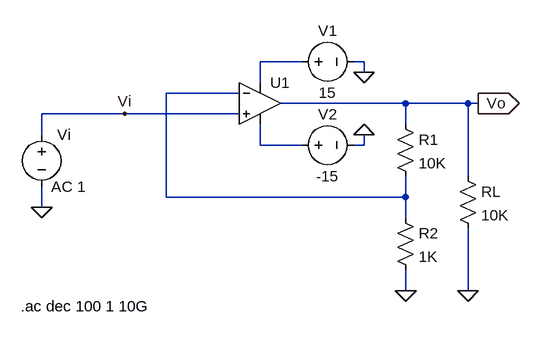
[diagram p0: schematic Run 1_D.asc]
Run 1_D.asc, the LTspice schematic file:
Version 4
SHEET 1 880 680
WIRE 224 32 160 32
WIRE 320 32 304 32
WIRE 320 48 320 32
WIRE 160 64 160 32
WIRE 128 80 16 80
WIRE 384 96 192 96
WIRE 480 96 384 96
WIRE 496 96 480 96
WIRE -48 112 -176 112
WIRE 128 112 -48 112
WIRE 384 128 384 96
WIRE -176 144 -176 112
WIRE 160 160 160 128
WIRE 224 160 160 160
WIRE 320 160 320 144
WIRE 320 160 304 160
WIRE 480 208 480 96
WIRE 16 240 16 80
WIRE 384 240 384 208
WIRE 384 240 16 240
WIRE -176 256 -176 224
WIRE 384 272 384 240
WIRE 384 384 384 352
WIRE 480 384 480 288
FLAG 320 48 0
FLAG 320 144 0
FLAG 384 384 0
FLAG 480 384 0
FLAG 496 96 Vo
IOPIN 496 96 Out
FLAG -176 256 0
FLAG -48 112 Vi
SYMBOL OpAmps\\UniversalOpamp2 160 96 R0
SYMATTR InstName U1
SYMBOL voltage 208 32 R270
WINDOW 0 32 56 VTop 2
WINDOW 3 -32 56 VBottom 2
WINDOW 123 0 0 Left 0
WINDOW 39 0 0 Left 0
SYMATTR InstName V1
SYMATTR Value 15
SYMBOL voltage 208 160 R270
WINDOW 0 32 56 VTop 2
WINDOW 3 -32 56 VBottom 2
WINDOW 123 0 0 Left 0
WINDOW 39 0 0 Left 0
SYMATTR InstName V2
SYMATTR Value -15
SYMBOL res 368 112 R0
SYMATTR InstName R1
SYMATTR Value 10K
SYMBOL res 368 256 R0
SYMATTR InstName R2
SYMATTR Value 1K
SYMBOL res 464 192 R0
SYMATTR InstName RL
SYMATTR Value 10K
SYMBOL voltage -176 128 R0
WINDOW 3 4 98 Left 2
WINDOW 123 15 96 Left 2
WINDOW 39 0 0 Left 0
SYMATTR Value ""
SYMATTR Value2 AC 1
SYMATTR InstName Vi
TEXT -208 408 Left 2 !.ac dec 100 1 10G

The netlist it stands for:
* Run 1_D.asc
XU1 Vi N002 N001 N003 Vo level.2 Avol=1Meg GBW=10Meg Slew=10Meg ilimit=25m rail=0 Vos=0 phimargin=45 en=0 enk=0 in=0 ink=0 Rin=500Meg  ; pins IN+ IN- V+ V- OUT
V1 N001 0 15
V2 N003 0 -15
R1 Vo N002 10K
R2 N002 0 1K
RL Vo 0 10K
Vi Vi 0 AC 1
.ac dec 100 1 10G
.lib UniversalOpamps2.sub
.backanno
.end